# EAGLE design 1TTR4--- Cumbo.Fabio --- PIC Simple (EAGLE 7.7.0)
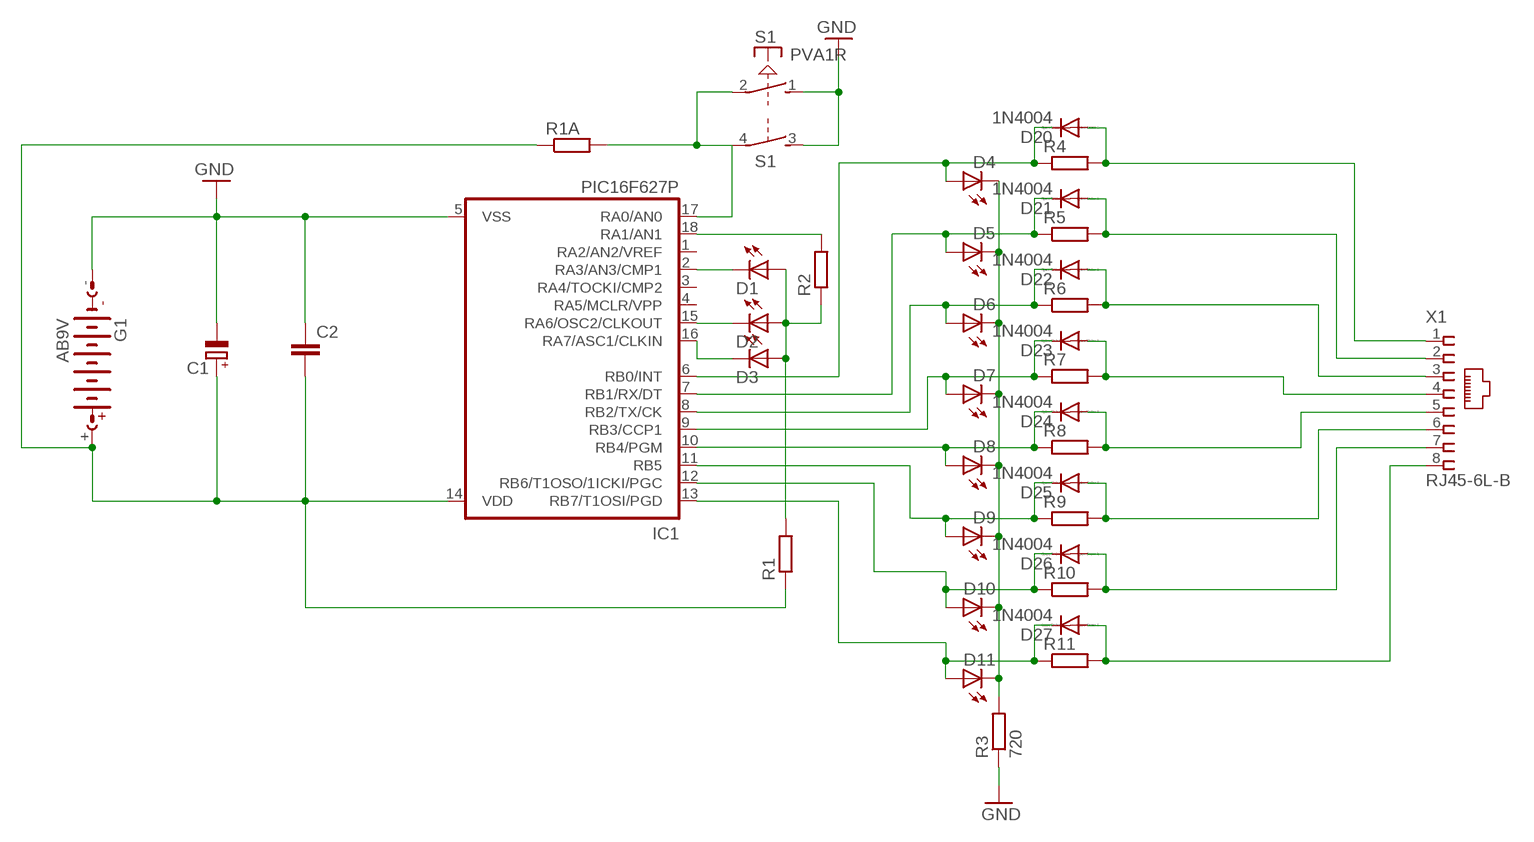
[diagram p0: schematic, sheet 1]

## Parts
C1  CPOL-EUE5-6  [E5-6]
C2  C-EU050-024X044  [C050-024X044]
D1  LED5MM  [LED5MM]
D2  LED5MM  [LED5MM]
D3  LED5MM  [LED5MM]
D4  LED5MM  [LED5MM]
D5  LED5MM  [LED5MM]
D6  LED5MM  [LED5MM]
D7  LED5MM  [LED5MM]
D8  LED5MM  [LED5MM]
D9  LED5MM  [LED5MM]
D10  LED5MM  [LED5MM]
D11  LED5MM  [LED5MM]
D20  1N4004  [DO41-10]
D21  1N4004  [DO41-10]
D22  1N4004  [DO41-10]
D23  1N4004  [DO41-10]
D24  1N4004  [DO41-10]
D25  1N4004  [DO41-10]
D26  1N4004  [DO41-10]
D27  1N4004  [DO41-10]
G1  AB9V  [AB9V]
IC1  PIC16F627P  [DIL18]
R1  R-EU_0204/7  [0204/7]
R1A  R-EU_0204/7  [0204/7]
R2  R-EU_0204/7  [0204/7]
R3  720  R-EU_0204/7  [0204/7]
R4  R-EU_0204/7  [0204/7]
R5  R-EU_0204/7  [0204/7]
R6  R-EU_0204/7  [0204/7]
R7  R-EU_0204/7  [0204/7]
R8  R-EU_0204/7  [0204/7]
R9  R-EU_0204/7  [0204/7]
R10  R-EU_0204/7  [0204/7]
R11  R-EU_0204/7  [0204/7]
S1  PVA1R  [PVA1R]
X1  RJ45-6L-B  [RJ45-NO-SHIELD]

## Nets
GND: C1.- C2.1 G1.- IC1.5(VSS) R3.1 S1.1(1:S) S1.3(2:S)
N$1: D11.A D27.C IC1.13(RB7/T1OSI/PGD) R11.1
N$2: D27.A R11.2 X1.8
N$3: D10.A D26.C IC1.12(RB6/T1OSO/1ICKI/PGC) R10.1
N$4: D9.A D25.C IC1.11(RB5) R9.1
N$5: D24.A R8.2 X1.5
N$6: D23.A R7.2 X1.4
N$7: D22.A R6.2 X1.3
N$8: D21.A R5.2 X1.2
N$9: D20.A R4.2 X1.1
N$10: D1.K(C) IC1.2(RA3/AN3/CMP1)
N$11: D25.A R9.2 X1.6
N$12: D7.A D23.C IC1.9(RB3/CCP1) R7.1
N$13: D26.A R10.2 X1.7
N$14: D6.A D22.C IC1.8(RB2/TX/CK) R6.1
N$15: D5.A D21.C IC1.7(RB1/RX/DT) R5.1
N$16: D4.A D20.C IC1.6(RB0/INT) R4.1
N$17: D4.K(C) D5.K(C) D6.K(C) D7.K(C) D8.K(C) D9.K(C) D10.K(C) D11.K(C) R3.2
N$18: C1.+ C2.2 G1.+ IC1.14(VDD) R1.1 R1A.1
N$19: IC1.17(RA0/AN0) R1A.2 S1.2(1:P) S1.4(2:P)
N$21: D8.A D24.C IC1.10(RB4/PGM) R8.1
N$22: D3.K(C) IC1.16(RA7/ASC1/CLKIN)
N$23: D2.K(C) IC1.15(RA6/OSC2/CLKOUT)
N$25: IC1.18(RA1/AN1) R2.2
N$26: D1.A D2.A D3.A R1.2 R2.1
Unconnected: IC1.1(RA2/AN2/VREF) IC1.3(RA4/TOCKI/CMP2) IC1.4(RA5/MCLR/VPP)

## Library data of the parts
C1 = resistor:CPOL-EU: POLARIZED CAPACITOR, European symbol
C2 = resistor:C-EU: CAPACITOR, European symbol
D1-D11 = led:LED: LED OSRAM: - CHIPLED LG R971, LG N971, LY N971, LG Q971, LY Q971, LO R971, LY R971 LH N974, LH R974 LS Q976, LO Q976, LY Q976 LO Q996 - Hyper CHIPLED LW Q18S LB Q993, LB Q99A, LB R99A - SideLED LS A670, LO A670, LY A670, LG A670, LP A670 LB A673, LV A673, LT A673, LW A673 LH A674 LY A675 LS A676, LA A676, LO A676, LY A676, LW A676 LS A679, LY A679, LG A679 - Hyper Micro SIDELED® LS Y876, LA Y876, LO Y876, LY Y876 LT Y87S - SmartLED LW L88C, LW L88S LB L89C, LB L89S, LG L890 LS L89K, LO L89K, LY L89K LS L896, LA L896, LO L896, LY L896 - TOPLED LS T670, LO T670, LY T670, LG T670, LP T670 LSG T670, LSP T670, LSY T670, LOP T670, LYG T670 LG T671, LOG T671, LSG T671 LB T673, LV T673, LT T673, LW T673 LH T674 LS T676, LA T676, LO T676, LY T676, LB T676, LH T676, LSB T676, LW T676 LB T67C, LV T67C, LT T67C, LS T67K, LO T67K, LY T67K, LW E67C LS E67B, LA E67B, LO E67B, LY E67B, LB E67C, LV E67C, LT E67C LW T67C LS T679, LY T679, LG T679 LS T770, LO T770, LY T770, LG T770, LP T770 LB T773, LV T773, LT T773, LW T773 LH T774 LS E675, LA E675, LY E675, LS T675 LS T776, LA T776, LO T776, LY T776, LB T776 LHGB T686 LT T68C, LB T68C - Hyper Mini TOPLED® LB M676 - Mini TOPLED Santana® LG M470 LS M47K, LO M47K, LY M47K Source: http://www.osram.convergy.de LUXEON: - LUMILED® LXK2-PW12-R00, LXK2-PW12-S00, LXK2-PW14-U00, LXK2-PW14-V00 LXK2-PM12-R00, LXK2-PM12-S00, LXK2-PM14-U00 LXK2-PE12-Q00, LXK2-PE12-R00, LXK2-PE12-S00, LXK2-PE14-T00, LXK2-PE14-U00 LXK2-PB12-K00, LXK2-PB12-L00, LXK2-PB12-M00, LXK2-PB14-N00, LXK2-PB14-P00, LXK2-PB14-Q00 LXK2-PR12-L00, LXK2-PR12-M00, LXK2-PR14-Q00, LXK2-PR14-R00 LXK2-PD12-Q00, LXK2-PD12-R00, LXK2-PD12-S00 LXK2-PH12-R00, LXK2-PH12-S00 LXK2-PL12-P00, LXK2-PL12-Q00, LXK2-PL12-R00 Source: www.luxeon.com KINGBRIGHT: KA-3528ASYC Source: www.kingbright.com
D20-D27 = diode:1N4004: DIODE general purpose rectifier, 1 A
G1 = battery:AB9V: 9-V BATTERY CLIP
IC1 = microchip:PIC16*F62: FLASH-Based 8-Bit CMOS Microcontroller Source: http://ww1.microchip.com/downloads/en/DeviceDoc/40300C.pdf; MF: MICROCHIP; MPN: PIC16F627-20I/P; OC_FARNELL: 1084298; OC_NEWARK: 23C4967
R1 R1A R2-R11 = resistor:R-EU_: RESISTOR, European symbol
S1 = switch-misc:PVA1R: ITT SWITCH
X1 = con-tycoelectronics:RJ45: CORCOM Modular RJ Jacks No Shield Source: www.tycoelectronics.com .. ENG_DS_1654001_1099_RJ_L_0507.pdf; MPN: RJ45-6L-B; OC_FARNELL: unknown; OC_NEWARK: 16R6090

## Net classes
0 default: width 2 mm, drill 0.8 mm, clearance 0.2 mm

## Board
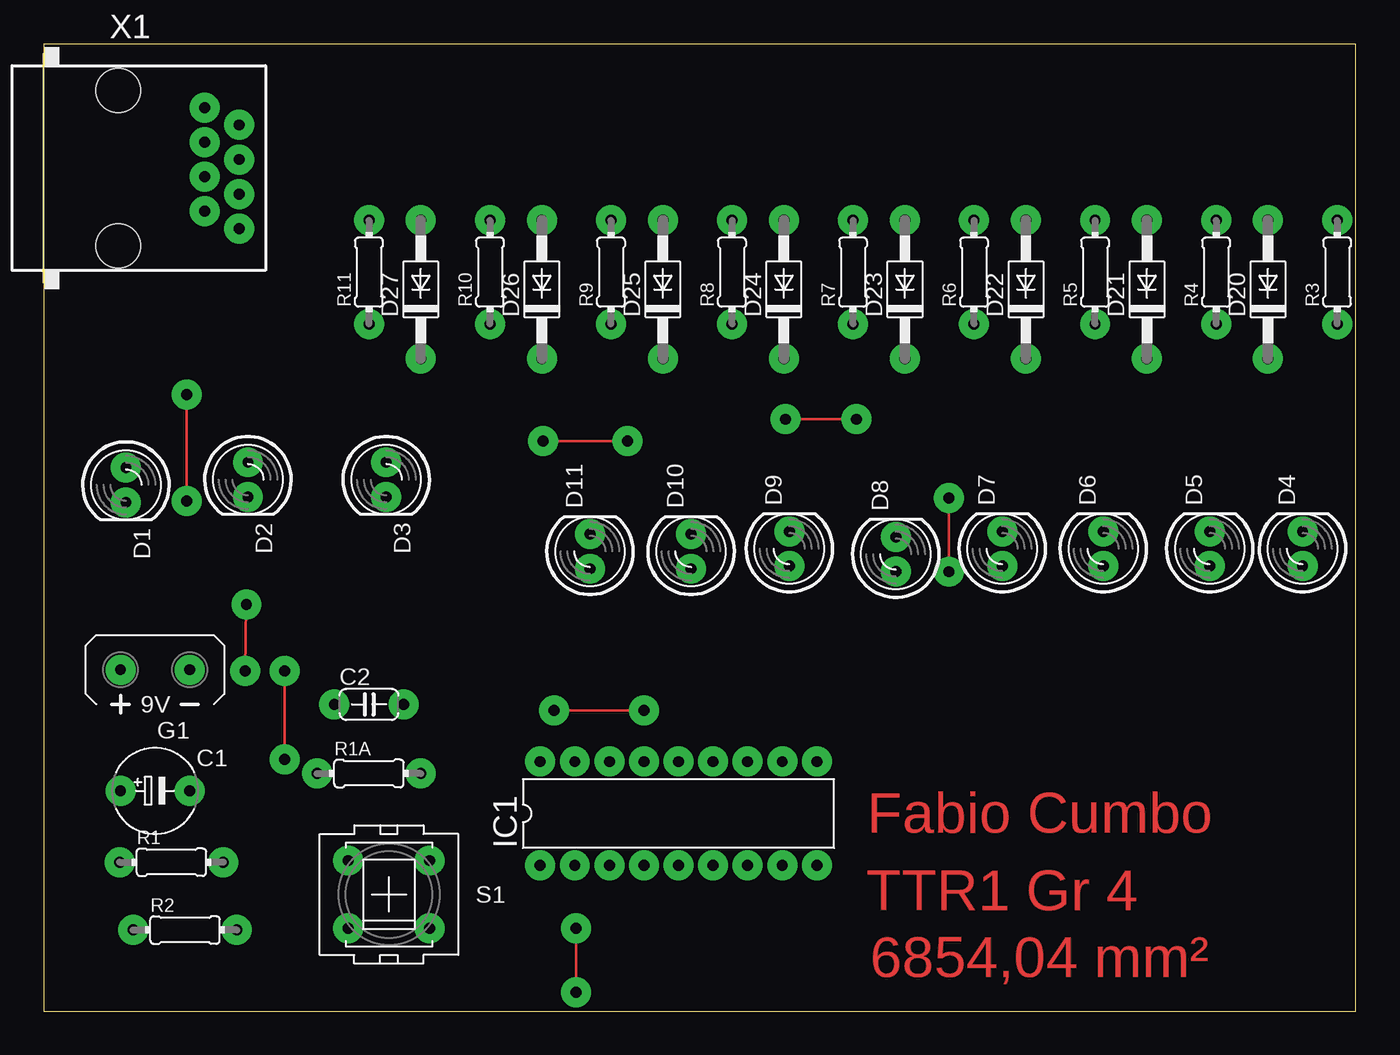
[diagram p1: board, top side]
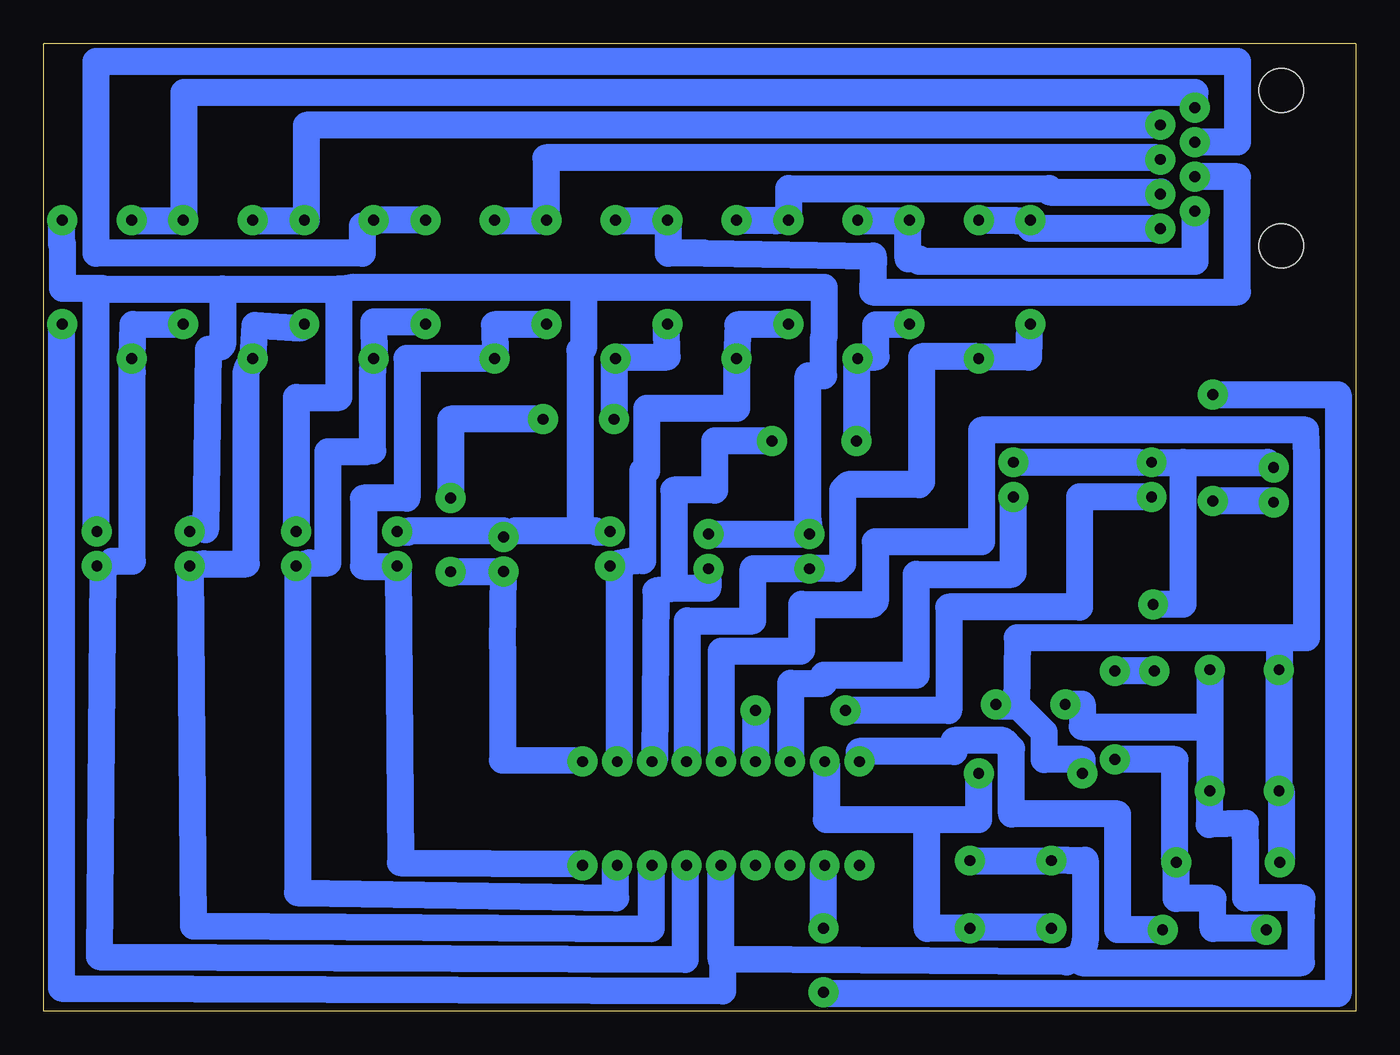
[diagram p2: board, bottom side, seen from below]

Size 96.43 x 71.1 mm. Coordinates in mm from the lower left corner, seen from the top.
Outline: 0.03,0 96.43,0 96.43,71.1 0.03,71.1 0.03,0
Copper layers (1*16): Top 0.035mm / dielectric 1.5mm / Bottom 0.035mm
Design rules "default": minimum track width 10mil, minimum drill 24mil, track to track 8mil, track to pad 8mil, pad to pad 8mil, via to via 8mil, smd to smd 8mil, copper to edge 40mil, drill to drill 8mil, minimum pad ring 10mil, minimum via ring 8mil, stop-mask expansion 4mil, vias tented up to drill 0mil, thermal gap 10mil

### Footprints (pad centres in the part's own frame; a part is rotated, then mirrored left to right if it is on the bottom)
E5-6 = drill 0.8 pad 2.2: + -2.54,0; - 2.54,0
C050-024X044 = drill 0.8 pad 2.2: 1 -2.54,0; 2 2.54,0
LED5MM = drill 0.8 pad 2.2: A -1.27,0; K 1.27,0
DO41-10 = drill 0.8 pad 2.2: A 5.08,0; C -5.08,0
AB9V = drill 0.8 pad 2.2: + 0,2.54; - 0,-2.54
DIL18 = drill 0.8 pad 2.2: 1 -10.16,-3.81; 2 -7.62,-3.81; 3 -5.08,-3.81; 4 -2.54,-3.81; 5 0,-3.81; 6 2.54,-3.81; 7 5.08,-3.81; 8 7.62,-3.81; 9 10.16,-3.81; 10 10.16,3.81; 11 7.62,3.81; 12 5.08,3.81; 13 2.54,3.81; 14 0,3.81; 15 -2.54,3.81; 16 -5.08,3.81; 17 -7.62,3.81; 18 -10.16,3.81
0204/7 = drill 0.8 pad 2.2: 1 -3.81,0; 2 3.81,0
PVA1R = drill 0.8 pad 2.2: 1 -2.997,2.489; 2 -2.997,-2.489; 3 2.997,2.489; 4 2.997,-2.489
RJ45-NO-SHIELD = drill 0.8 pad 2.2: 1 -4.445,6.35; 2 -3.175,8.89; 3 -1.905,6.35; 4 -0.635,8.89; 5 0.635,6.35; 6 1.905,8.89; 7 3.175,6.35; 8 4.445,8.89 | hole 3.251: -5.715,0; 5.715,0

### Placement (x,y rotation side)
C1  8.22,16.21 0 top
C2  23.93,22.56 0 top
D1  6.08,38.67 270 top
D2  15.04,39.07 270 top
D3  25.2,39.07 270 top
D4  92.51,33.99 90 top
D5  85.69,33.99 90 top
D6  77.87,33.99 90 top
D7  70.45,33.99 90 top
D8  62.63,33.59 90 top
D9  54.81,33.99 90 top
D10  47.59,33.79 90 top
D11  40.17,33.79 90 top
D20  89.97,53.04 90 top
D21  81.08,53.04 90 top
D22  72.19,53.04 90 top
D23  63.3,53.04 90 top
D24  54.41,53.04 90 top
D25  45.52,53.04 90 top
D26  36.63,53.04 90 top
D27  27.74,53.04 90 top
G1  8.22,25.1 90 top
IC1  46.67,14.54 0 top
R1  9.42,10.96 0 top
R1A  23.93,17.48 0 top
R2  10.42,5.98 0 top
R3  95.05,54.31 90 top
R4  86.16,54.31 90 top
R5  77.27,54.31 90 top
R6  68.38,54.31 90 top
R7  59.49,54.31 90 top
R8  50.6,54.31 90 top
R9  41.71,54.31 90 top
R10  32.82,54.31 90 top
R11  23.93,54.31 90 top
S1  25.4,8.59 0 top
X1  5.51,61.95 270 top

### Tracks (layer width: path | path; a pad name or v marks a point on that pad's centre or on a via)
GND
  Bottom 2: 10.78,20.9 10.78,25.07 G1.- | 10.78,20.9 10.78,16.32 C1.- 10.81,16.21 10.81,13.72 8.16,13.82 8.13,11.5 8.13,8.32 4.01,8.32 4.03,6.95 4.03,3.58 20.16,3.58 20.24,4.06 | C2.1 21.28,22.57 20.13,22.57 20.13,20.9 10.78,20.9 | S1.3 28.16,11.07 22.28,11.07 S1.1 21.28,11.1 19.91,11.1 19.91,5.2 20.24,4.06 | 46.53,3.83 21.28,3.62 20.24,4.06 | 46.53,3.83 46.66,3.83 46.66,10.7 IC1.5 | R3.1 95.13,50.5 95.13,1.7 46.53,1.5 46.53,3.83
N$1
  Bottom 2: R11.1 24.03,50.45 24.08,48.05 27.66,48.08 D27.C 27.88,48.1 31.93,48.1 31.93,38.9 32.13,38.7 37.33,38.7 37.73,38.3 37.73,32.9 38.11,32.52 D11.A | IC1.13 49.16,18.45 49.16,28.7 44.33,28.7 44.33,32.3 44.31,32.52 D11.A | 40.28,32.45 D11.A
N$2
  Bottom 2: 23.91,58.2 R11.2 | D27.A 27.66,58.08 24.91,58.08 R11.2 | X1.8 23.93,57.51 R11.2
N$3  (via drill 0.8 pad 2.2)
  Top 0.2: v36.73,41.9 v42.93,41.9
  Bottom 2: 50.13,31.07 47.63,31.07 47.66,32.45 D10.A | 50.13,31.07 51.46,30.88 51.56,18.45 IC1.12 | R10.1 35.31,50.45 35.28,48.08 36.53,48.08 D26.C 36.73,47.96 v36.73,41.9 | v42.93,41.9 47.13,41.9 47.13,38.3 50.13,38.3 50.13,31.07
N$4
  Bottom 2: R9.1 41.78,50.45 45.43,50.45 D25.C 45.53,44.3 52.13,44.3 52.13,39.7 52.43,39.7 52.43,33.1 52.91,33.12 54.13,32.92 | 54.13,32.92 D9.A | IC1.11 54.13,18.51 54.13,32.92
N$5
  Bottom 2: D24.A 54.41,58.08 50.66,58.08 R8.2 50.53,58.12 50.53,55.7 47.78,55.7 35.48,55.5 35.53,52.85 8.73,52.85 8.73,61.32 X1.5
N$6
  Bottom 2: D23.A 63.28,58.08 59.53,58.08 R7.2 59.53,58.12 59.53,62.7 14.6,62.7 X1.4
N$7
  Bottom 2: R6.2 68.41,58.08 68.45,58.12 D22.A | 72.16,58.08 D22.A | D22.A 73.03,57.7 73.03,55.7 92.58,55.7 92.58,69.8 8.73,69.8 8.73,63.86 X1.3
N$8
  Bottom 2: R5.2 77.28,58.08 81.03,58.08 D21.A | 77.21,58.18 R5.2 | X1.2 14.4,65.1 77.13,65.1 77.13,58.12 R5.2
N$9
  Bottom 2: 86.28,58.08 89.91,58.08 D20.A | 86.28,58.08 R4.2 | X1.1 11.86,67.5 86.13,67.5 86.13,58.08 86.28,58.08
N$10  (via drill 0.8 pad 2.2)
  Top 0.2: v10.53,37.5 v10.53,45.3 | v39.13,1.4 v39.13,6.1
  Bottom 2: v10.53,45.3 1.33,45.3 1.33,1.3 39.13,1.3 v39.13,1.4 | D1.K 6.08,37.5 v10.53,37.5 | v39.13,6.1 39.13,10.73 IC1.2
N$11
  Bottom 2: D25.A 45.41,58.08 42.66,58.08 R9.2 | 41.73,58.12 R9.2 | X1.6 14.33,60.2 22.53,60.2 22.58,60.45 41.71,60.45 R9.2
N$12
  Bottom 2: R7.1 59.53,50.45 63.31,50.45 63.28,48.08 D23.C 69.73,47.96 69.73,37.7 72.93,37.7 72.93,32.7 70.45,32.7 D7.A 70.41,32.7 70.21,10.92 56.91,10.82 IC1.9
N$13
  Bottom 2: D26.A 36.53,58.08 32.91,58.08 R10.2 32.93,58.12 32.93,55.3 32.13,55.3 32.13,55.1 11.83,55.1 11.83,58.7 X1.7
N$14
  Bottom 2: R6.1 68.41,50.65 72.18,50.65 72.16,48.08 D22.C 72.26,47.08 72.26,41.2 72.76,41.1 75.53,41.1 75.53,32.95 76.91,32.95 D6.A 77.78,32.7 77.78,8.72 54.41,8.32 54.41,10.7 IC1.8
N$15
  Bottom 2: R5.1 77.28,50.45 77.53,50.2 80.91,50.4 81.03,48.08 D21.C 81.53,47.08 81.53,32.88 84.66,32.88 D5.A 85.66,32.7 85.43,6.28 51.78,6.08 51.78,10.7 IC1.7
N$16
  Bottom 2: R4.1 86.28,50.45 89.86,50.48 89.91,48.08 D20.C 89.91,46.95 89.91,33.08 91.41,33.08 92.09,32.39 | 92.09,32.39 92.41,32.7 D4.A | 92.09,32.39 92.33,4.03 49.28,3.83 49.28,10.7 IC1.6
N$17
  Bottom 2: D7.K 70.41,35.2 69.66,35.2 69.53,35.33 62.66,35.33 62.66,34.95 D8.K 61.78,35.33 57.03,35.33 | 57.03,35.33 55.91,35.33 55.78,35.2 54.91,35.2 D9.K | D10.K 47.53,35.08 40.28,35.08 D11.K 40.28,36.08 40.28,46.7 39.13,46.7 39.13,49.58 39.11,49.58 39.11,53.2 56.76,53.2 | 92.56,53.08 83.28,53.08 | 83.28,53.08 74.73,53.08 | 74.73,53.08 74.41,53.08 73.53,53.2 56.76,53.2 | R3.2 95.03,58.08 95.13,57.88 95.13,56.38 95.03,56.38 95.03,53.1 92.16,53.1 92.56,53.08 | 83.28,53.08 83.28,48.95 83.41,48.83 84.33,48.62 84.53,35.38 84.66,35.45 85.53,35.45 85.66,35.33 D5.K | D4.K 92.53,35.33 92.56,35.33 92.56,53.08 | 57.03,35.33 57.03,48.58 56.91,48.7 56.78,48.7 56.76,48.83 56.76,53.2 | 74.73,53.08 74.73,45.1 77.87,45.1 D6.K
N$18
  Bottom 2: 24.97,22.39 25.03,22.45 26.41,22.45 C2.2 | R1.1 5.53,10.95 5.53,16.2 5.66,16.2 C1.+ G1.+ 5.63,25.1 5.63,27.45 | IC1.14 46.66,18.45 46.66,26.45 40.83,26.45 40.73,26.55 40.73,29.9 35.53,29.9 35.33,30.1 35.33,34.5 27.53,34.5 27.53,42.7 3.73,42.7 3.66,40.83 3.66,27.45 5.63,27.45 | 24.97,22.39 24.91,27.45 5.63,27.45 | 20.16,17.57 20.13,17.6 | 20.13,17.6 20.13,18.5 22.93,18.5 22.93,20.5 24.82,22.39 24.97,22.39 | R1A.1 20.03,17.45 20.13,17.6
N$19
  Bottom 2: 28.16,6.2 S1.4 | 28.16,6.2 22.48,6.2 S1.2 | 28.16,6.2 28.26,6.1 31.53,6.1 31.53,14.1 | 31.53,14.1 27.73,14.1 27.74,14.11 R1A.2 | IC1.17 38.93,18.23 38.93,14.1 31.53,14.1
N$21  (via drill 0.8 pad 2.2)
  Top 0.2: v54.53,43.5 v59.73,43.5 | v66.53,37.7 v66.53,32.3
  Bottom 2: IC1.10 56.91,18.45 62.73,18.47 62.73,26.8 D8.A 62.63,32.3 v66.53,32.3 | R8.1 50.66,50.45 50.63,48.08 54.41,48.08 D24.C 54.53,47.96 v54.53,43.5 | v59.73,43.5 66.53,43.5 v66.53,37.7
N$22
  Bottom 2: IC1.16 41.53,18.45 41.53,24.1 39.13,24.1 39.13,24.7 32.33,24.7 32.33,32.1 25.33,32.1 25.2,32.23 D3.K 25.28,37.7
N$23  (via drill 0.8 pad 2.2)
  Top 0.2: v37.53,22.1 v44.13,22.1
  Bottom 2: D2.K 20.33,37.8 20.33,29.7 29.93,29.7 29.93,22.1 v37.53,22.1 | v44.13,22.1 IC1.15
N$25
  Bottom 2: R2.2 14.55,6 17.53,6 17.53,14.5 25.33,14.5 25.33,19.3 25.93,19.9 29.53,19.9 29.53,19.1 36.53,19.1 36.51,19.08 IC1.18
N$26  (via drill 0.8 pad 2.2)
  Top 0.2: v14.93,29.9 v14.83,25 | v17.73,25 v17.73,18.5
  Bottom 2: 12.73,40.33 6.53,40.33 6.16,39.95 D1.A | D3.A 25.16,40.33 16.03,40.33 D2.A 15.03,40.33 12.73,40.33 | 12.73,40.33 12.73,29.9 v14.93,29.9 | v14.83,25 v17.73,25 | R2.1 6.73,6.1 10.53,6.1 10.53,8.3 13.23,8.3 R1.2 13.33,10.96 13.33,18.5 v17.73,18.5

### Text on the board
Top: Fabio Cumbo | TTR1 Gr 4 | 6854,04 mm²